# Altium schematic sheet Sheet1.SchDoc
size A
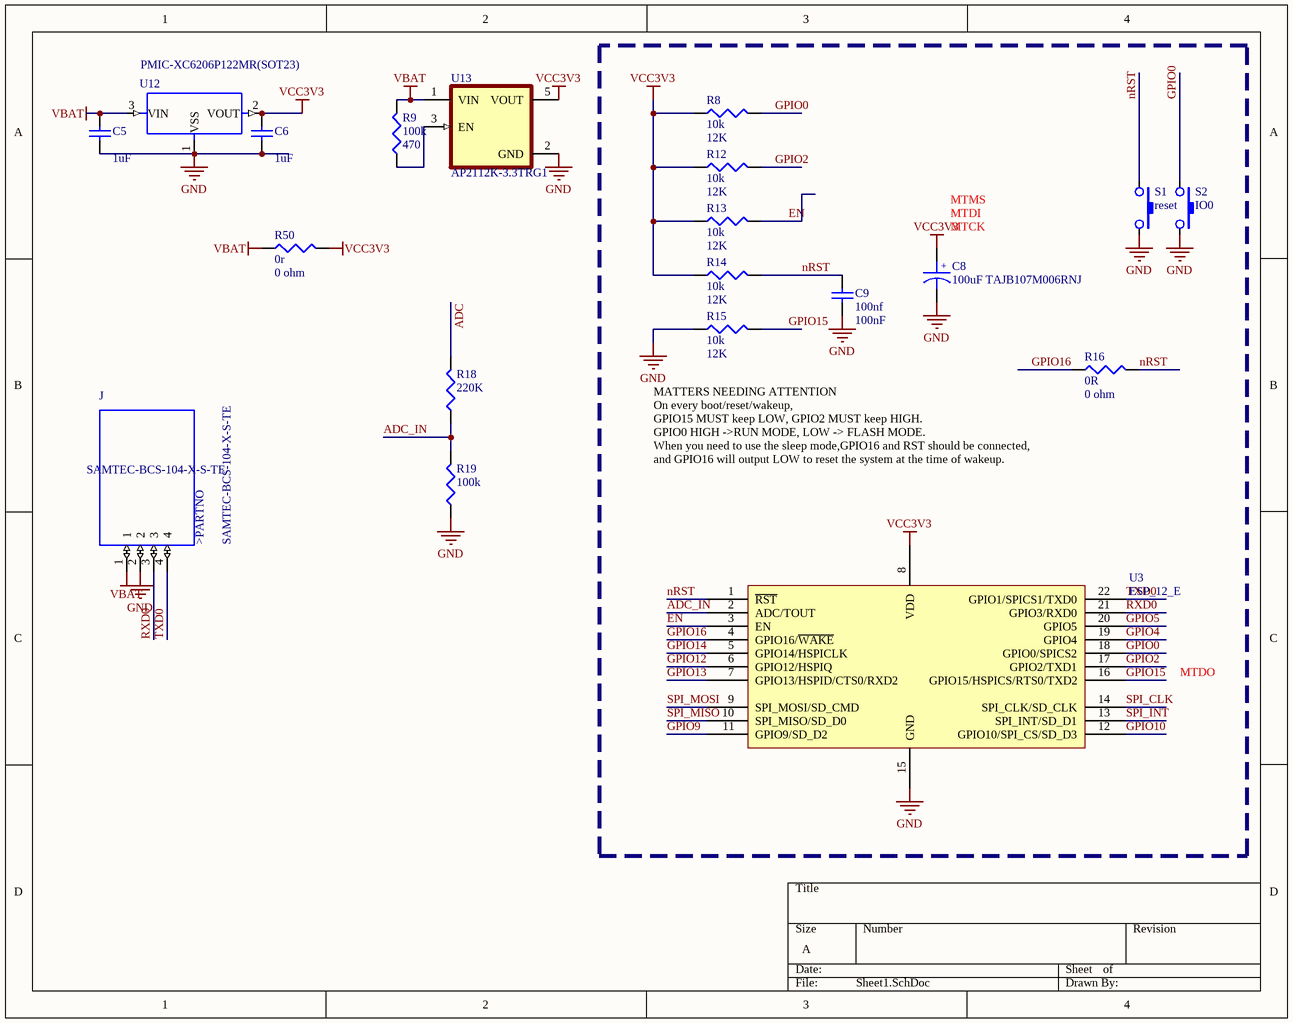
[diagram p0: Sheet1.SchDoc]

## Parts
C5  value 1uF  [1608[0603]]
C6  value 1uF  [1608[0603]]
C8  100uF TAJB107M006RNJ  [SMT_C_Tantalum_B]
C9  100nf  [1608[0603]]
J  SAMTEC-BCS-104-X-S-TE  [SAMTEC-BCS-104-X-S-TE]
R8  10k  value 12K  [J1-0603]
R9  100k  value 470  [J1-0603]
R12  10k  value 12K  [J1-0603]
R13  10k  value 12K  [J1-0603]
R14  10k  value 12K  [J1-0603]
R15  10k  value 12K  [J1-0603]
R16  0R  value 0 ohm  [J1-0603]
R18  220K  [J1-0603]
R19  100k  [J1-0603]
R50  0r  value 0 ohm  [J1-0603]
S1  reset  [SMT_SW_PTS_820]
S2  IO0  [SMT_SW_PTS_820]
U3  ESP_12_E  [ESP_12_E_L]
U12  PMIC-XC6206P122MR(SOT23)  [SOT-23]
U13  AP2112K-3.3TRG1  [SOT95P285X140-5N]

## Nets
GND: C5.1 C6.1 C8.2 C9.1 J.2 R15.1 R19.1 S1.2 S2.2 U3.15(GND) U12.1(VSS) U13.2(GND)
VBAT: C5.2 J.1 R9.2 R50.1 U12.3(VIN) U13.1(VIN)
VCC3V3: C6.2 C8.1 R8.1 R12.1 R13.1 R14.1 R50.2 U3.8(VDD) U12.2(VOUT) U13.5(VOUT)
ADC: R18.2
ADC_IN: R18.1 R19.2 U3.2(ADC/TOUT)
EN: R13.2 U3.3(EN)
GPIO0: R8.2 S2.1 U3.18(GPIO0/SPICS2)
GPIO2: R12.2 U3.17(GPIO2/TXD1)
GPIO4: U3.19(GPIO4)
GPIO5: U3.20(GPIO5)
GPIO9: U3.11(GPIO9/SD_D2)
GPIO10: U3.12(GPIO10/SPI_CS/SD_D3)
GPIO12: U3.6(GPIO12/HSPIQ)
GPIO13: U3.7(GPIO13/HSPID/CTS0/RXD2)
GPIO14: U3.5(GPIO14/HSPICLK)
GPIO15: R15.2 U3.16(GPIO15/HSPICS/RTS0/TXD2)
GPIO16: R16.1 U3.4(GPIO16/~{WAKE})
nRST: C9.2 R14.2 R16.2 S1.1 U3.1(~{RST})
RXD0: J.3 U3.21(GPIO3/RXD0)
SPI_CLK: U3.14(SPI_CLK/SD_CLK)
SPI_INT: U3.13(SPI_INT/SD_D1)
SPI_MISO: U3.10(SPI_MISO/SD_D0)
SPI_MOSI: U3.9(SPI_MOSI/SD_CMD)
TXD0: J.4 U3.22(GPIO1/SPICS1/TXD0)
NetR9_1: R9.1 U13.3(EN)

## Notes on the sheet
- (near C8) MTCK
- (near C8) MTDI
- MTMS
- (near R16) MATTERS NEEDING ATTENTION
  On every boot/reset/wakeup,
  GPIO15 MUST keep LOW, GPIO2 MUST keep HIGH.
  GPIO0 HIGH ->RUN MODE, LOW -> FLASH MODE.
  When you need to use the sleep mode,GPIO16 and RST should be connected,
  and GPIO16 will output LOW to reset the system at the time of wakeup.
- MTDO
- (in symbol SAMTEC-BCS-104-X-S-TE) >PARTNO
- (in symbol SMT_C_Tantalum_B) +

## Library data of the parts
C5 C6 C9 = Cap Semi: Capacitor (Semiconductor SIM Model); Published: 8-Jun-2000; LatestRevisionDate: 29-May-2009; LatestRevisionNote: IPC-7351 Footprint Added.; PackageReference: C1206; Publisher: Altium Limited; PackageDescription: Chip Capacitor
  C9: Value: 100nF
C8 = SMT_C_Tantalum_B: Capacitor, SM Tantalum; Body 3.5 x 2.8 mm (LxW typ)
J = SAMTEC-BCS-104-X-S-TE: 4 Position Receptacle Connector Through Hole; MP: BCS-104-LM-S-TE; MF: Samtec; Price: None; Value: *; Package: None; SnapEDA_Link: https://www.snapeda.com/parts/BCS-104-LM-S-TE/Samtec/view-part/3331485/?ref=snap; Availability: Unavailable
R8 R9 R12-R16 R18 R19 R50 = Res3: Resistor; Published: 8-Jun-2000; LatestRevisionDate: 29-May-2009; LatestRevisionNote: IPC-7351 Footprint Added.; PackageReference: J1-0603; Publisher: Altium Limited; PackageDescription: Chip Resistor
S1 S2 = SMT_SW_PTS_820: SMT Tactile ‎Switch PTS 820 Series
U3 = ESP_12_E: ESP-12 Wi-Fi Module by AI-Thinker; IC: ESP8266-EX; Vendor: Ai-thinker
U12 = PMIC-XC6206P122MR(SOT23): Linear Voltage Regulator IC Output; MF: Torex; Value: *; Package: None; Price: None; MP: XC6206P122MR; Availability: Unavailable; SnapEDA_Link: https://www.snapeda.com/parts/XC6206P122MR/Torex/view-part/105791/?ref=snap
U13 = AP2112K-3.3TRG1: Linear Voltage Regulator IC 1 Output 600mA SOT-25; MF: Diodes Inc.; Digi-Key_Part_Number: AP2112K-3.3TRG1DICT-ND; SnapEDA_Link: https://www.snapeda.com/parts/AP2112K-3.3TRG1/Diodes%20Inc./view-part/454988/?ref=snap; Package: SOT-753 Diodes Inc.; MP: AP2112K-3.3TRG1; Value: *; Digi-Key_Purchase_URL: https://www.digikey.com.au/product-detail/en/diodes-incorporated/AP2112K-3.3TRG1/AP2112K-3.3TRG1DICT-ND/4505257?utm_source=snapeda&utm_medium=aggregator&utm_campaign=symbol